# Altium schematic sheet DAC8728_Main_Modified.SchDoc
size A3; Organization: University of Amsterdam; Address1: Technology Centre; DocumentNumber: 1; SheetNumber: 1; SheetTotal: 4
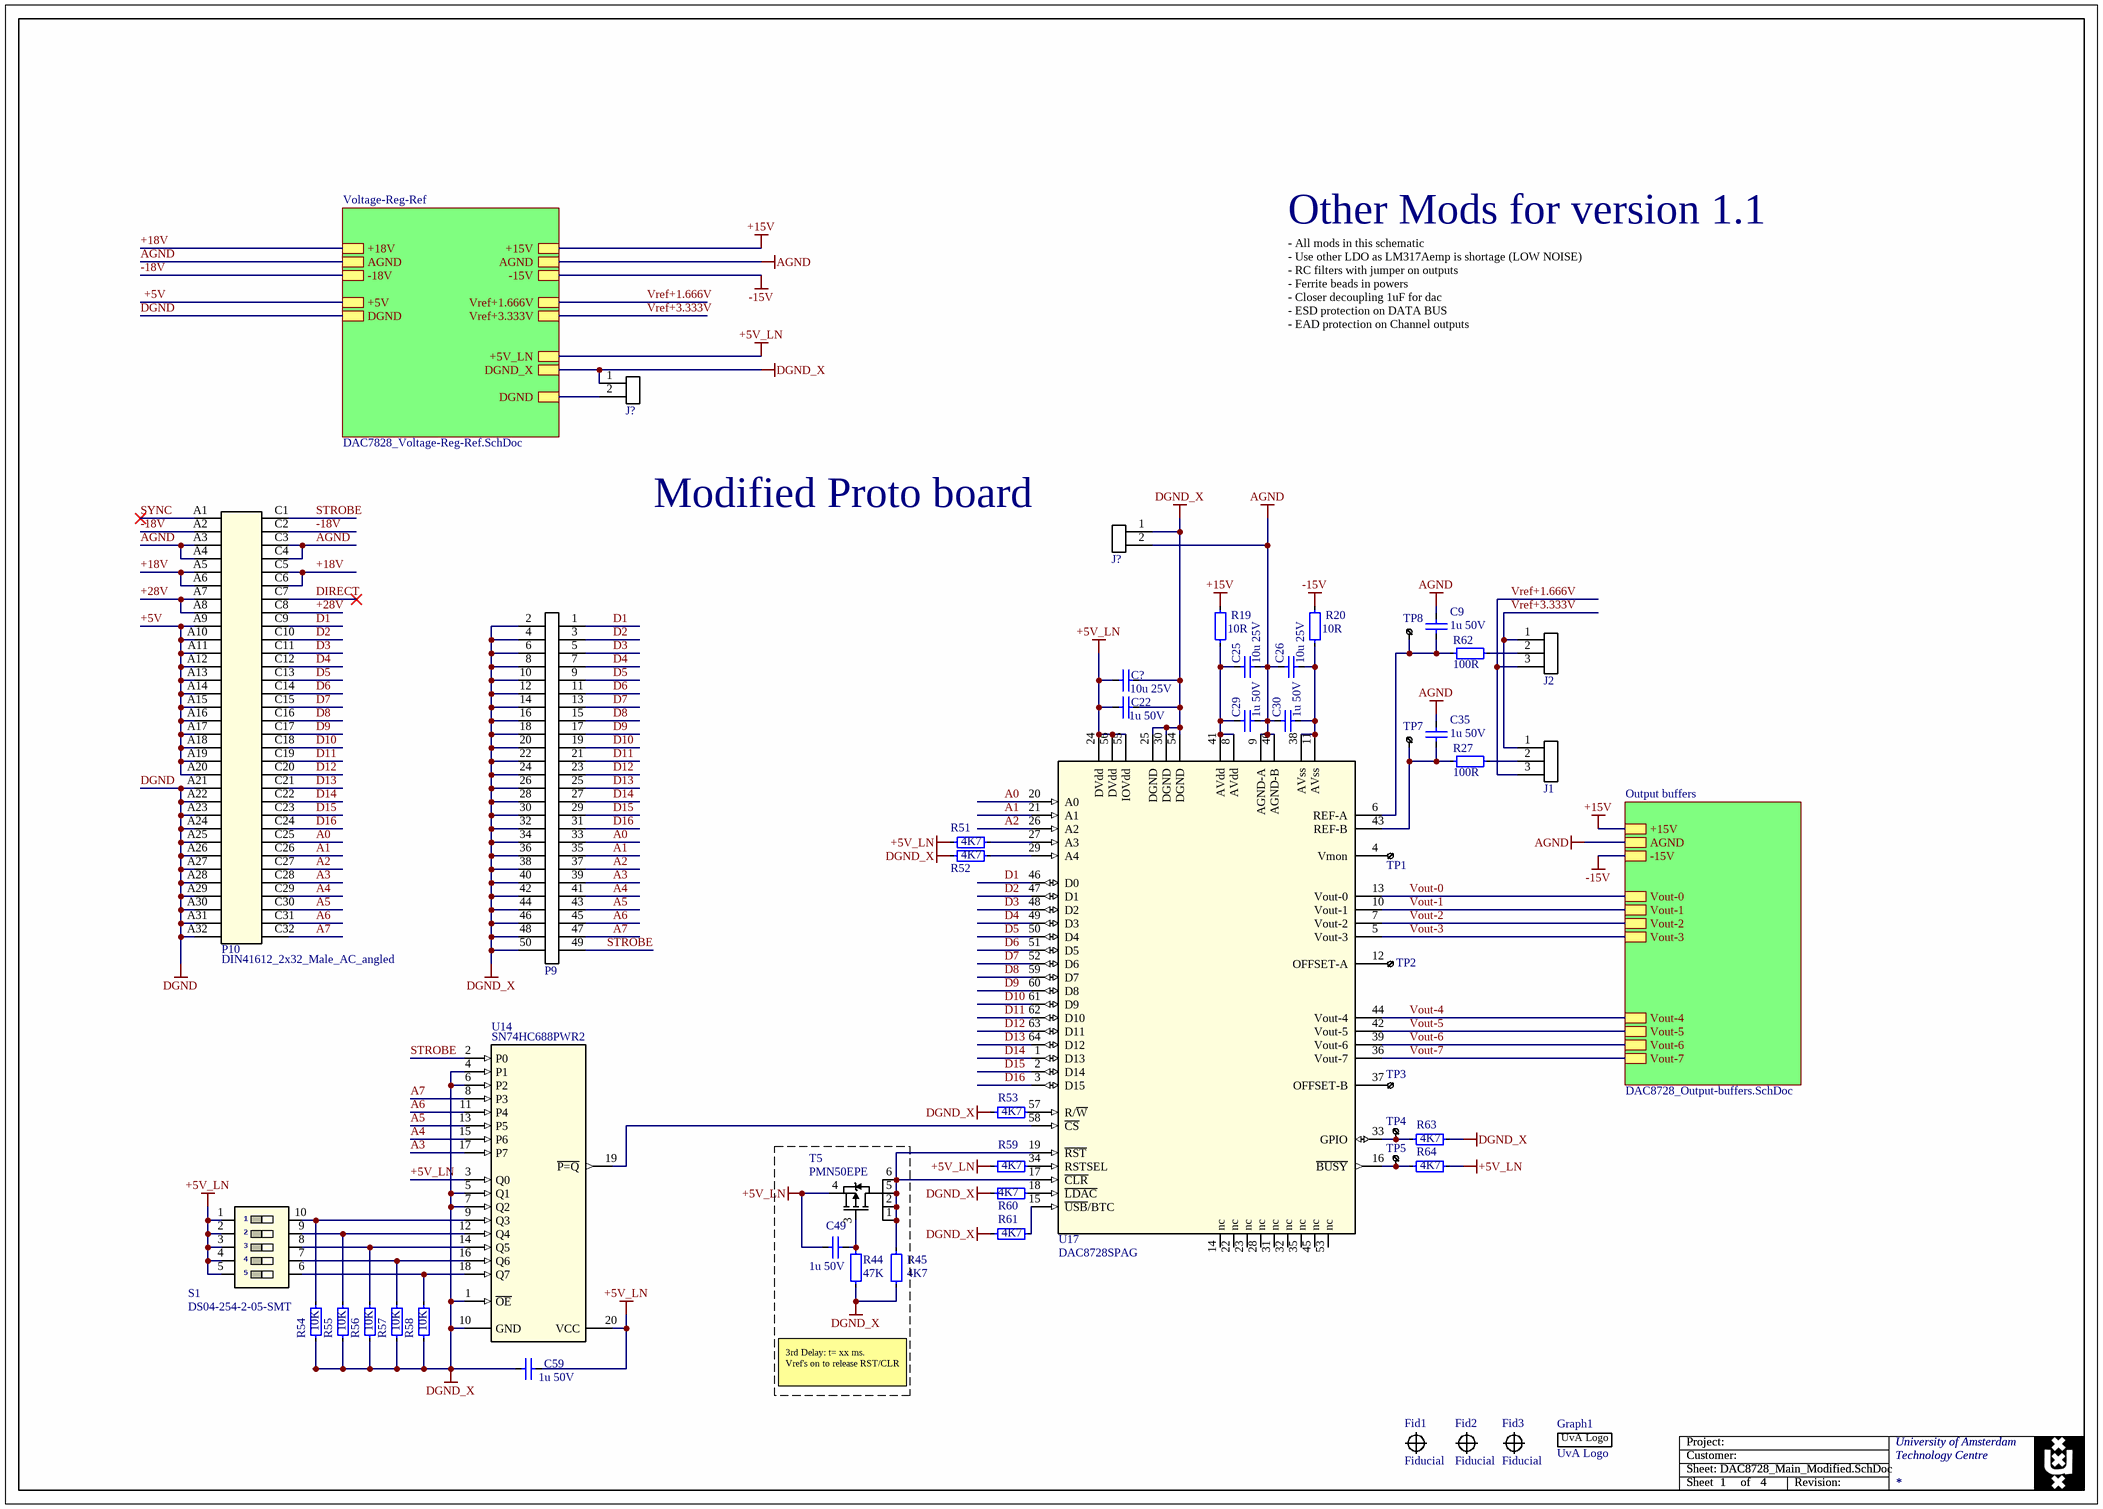
[diagram p0: DAC8728_Main_Modified.SchDoc]

## Parts
(Parts that share a designator on the sheet are numbered #1, #2 ... from top to bottom, then left to right.)
C9  1u 50V  [cap0603MD]
C22  1u 50V  [cap0603MD]
C25  10u 25V  [cap0805MD]
C26  10u 25V  [cap0805MD]
C29  1u 50V  [cap0603MD]
C30  1u 50V  [cap0603MD]
C35  1u 50V  [cap0603MD]
C49  1u 50V  [cap0603MD]
C59  1u 50V  [cap0603MD]
C?  10u 25V  [cap0805MD]
Fid1  Fiducial  [fiducial]
Fid2  Fiducial  [fiducial]
Fid3  Fiducial  [fiducial]
Graph1  UvA Logo  [UvA_Logo]
J1  Header 2.54  [Header254-1x3]  (value not drawn)
J2  Header 2.54  [Header254-1x3]  (value not drawn)
J?#1  Header 2.54  [Header254-1x2]  (value not drawn)
J?#2  Header 2.54  [Header254-1x2]  (value not drawn)
P9  Header 2.54  [Header254-2x25]  (value not drawn)
P10  DIN41612_2x32_Male_AC_angled  [DIN41612_2x32_Male_AC_angled]
R19  10R  [res0603MD]
R20  10R  [res0603MD]
R27  100R  [res0603MD]
R44  47K  [res0603MD]
R45  4K7  [res0603MD]
R51  4K7  [res0603MD]
R52  4K7  [res0603MD]
R53  4K7  [res0603MD]
R54  10K  [res0603HD]
R55  10K  [res0603HD]
R56  10K  [res0603HD]
R57  10K  [res0603HD]
R58  10K  [res0603HD]
R59  4K7  [res0603MD]
R60  4K7  [res0603MD]
R61  4K7  [res0603MD]
R62  100R  [res0603MD]
R63  4K7  [res0603MD]
R64  4K7  [res0603MD]
S1  DS04-254-2-05-SMT  [DS04-254-2-05-SMT]
T5  PMN50EPE  [TSOP95P280X110-6N]
TP1  Testpoint  [Testpoint_1mm]  (value not drawn)  (no BOM)
TP2  Testpoint  [Testpoint_1mm]  (value not drawn)  (no BOM)
TP3  Testpoint  [Testpoint_1mm]  (value not drawn)  (no BOM)
TP4  Testpoint  [Testpoint_1mm]  (value not drawn)  (no BOM)
TP5  Testpoint  [Testpoint_1mm]  (value not drawn)  (no BOM)
TP7  Testpoint  [Testpoint_1mm]  (value not drawn)  (no BOM)
TP8  Testpoint  [Testpoint_1mm]  (value not drawn)  (no BOM)
U14  SN74HC688PWR2  [SOIC127P1030X265-20N]
U17  DAC8728SPAG  [TSQFP50P1200X1200X105-64N]

## Sub-sheets
Output buffers = DAC8728_Output-buffers.SchDoc: +15V, AGND, -15V, Vout-1, Vout-2, Vout-3, Vout-4, Vout-5, Vout-6, Vout-7, Vout-0
Voltage-Reg-Ref = DAC7828_Voltage-Reg-Ref.SchDoc: +18V, AGND, -18V, +5V, DGND, +15V, +5V_LN, AGND, -15V, Vref+1.666V, Vref+3.333V, DGND_X, DGND

## Nets
+5V_LN: C22.1 C49.1 C59.2 C?.1 R51.1 R59.1 R64.2 S1.1(1a) S1.2(2a) S1.3(3a) S1.4(4a) S1.5(5a) T5.4(S) U14.3(Q0) U14.20(VCC) U17.24(DVdd) U17.55(IOVdd) U17.56(DVdd) ; sheet Voltage-Reg-Ref/+5V_LN
+15V: R19.2 ; sheet Voltage-Reg-Ref/+15V, sheet Output buffers/+15V
-15V: R20.2 ; sheet Voltage-Reg-Ref/-15V, sheet Output buffers/-15V
AGND: C9.2 C25.2 C26.1 C29.1 C30.2 C35.2 J?#2.2 P10.A3 P10.A4 P10.C3 P10.C4 U17.9(AGND-A) U17.40(AGND-B) ; sheet Voltage-Reg-Ref/AGND, sheet Voltage-Reg-Ref/AGND, sheet Output buffers/AGND
DGND: P10.A21 P10.A22 P10.A23 P10.A24 P10.A25 P10.A26 P10.A27 P10.A28 P10.A29 P10.A30 P10.A31 P10.A32 ; sheet Voltage-Reg-Ref/DGND
DGND_X: C22.2 C59.1 C?.2 J?#1.1 J?#2.1 P9.2 P9.4 P9.6 P9.8 P9.10 P9.12 P9.14 P9.16 P9.18 P9.20 P9.22 P9.24 P9.26 P9.28 P9.30 P9.32 P9.34 P9.36 P9.38 P9.40 P9.42 P9.44 P9.46 P9.48 P9.50 R44.1 R45.1 R52.1 R53.1 R54.1 R55.1 R56.1 R57.1 R58.1 R60.1 R61.1 R63.2 U14.1(~{OE}) U14.4(P1) U14.5(Q1) U14.6(P2) U14.7(Q2) U14.10(GND) U17.25(DGND) U17.30(DGND) U17.54(DGND) ; sheet Voltage-Reg-Ref/DGND_X
+5V: P10.A9 P10.A10 P10.A11 P10.A12 P10.A13 P10.A14 P10.A15 P10.A16 P10.A17 P10.A18 P10.A19 P10.A20 ; sheet Voltage-Reg-Ref/+5V
+18V: P10.A5 P10.A6 P10.C5 P10.C6 ; sheet Voltage-Reg-Ref/+18V
+28V: P10.A7 P10.A8 P10.C8
-18V: P10.A2 P10.C2 ; sheet Voltage-Reg-Ref/-18V
A0: P9.33 P10.C25 U17.20(A0)
A1: P9.35 P10.C26 U17.21(A1)
A2: P9.37 P10.C27 U17.26(A2)
A3: P9.39 P10.C28 U14.17(P7)
A4: P9.41 P10.C29 U14.15(P6)
A5: P9.43 P10.C30 U14.13(P5)
A6: P9.45 P10.C31 U14.11(P4)
A7: P9.47 P10.C32 U14.8(P3)
D1: P9.1 P10.C9 U17.46(D0)
D2: P9.3 P10.C10 U17.47(D1)
D3: P9.5 P10.C11 U17.48(D2)
D4: P9.7 P10.C12 U17.49(D3)
D5: P9.9 P10.C13 U17.50(D4)
D6: P9.11 P10.C14 U17.51(D5)
D7: P9.13 P10.C15 U17.52(D6)
D8: P9.15 P10.C16 U17.59(D7)
D9: P9.17 P10.C17 U17.60(D8)
D10: P9.19 P10.C18 U17.61(D9)
D11: P9.21 P10.C19 U17.62(D10)
D12: P9.23 P10.C20 U17.63(D11)
D13: P9.25 P10.C21 U17.64(D12)
D14: P9.27 P10.C22 U17.1(D13)
D15: P9.29 P10.C23 U17.2(D14)
D16: P9.31 P10.C24 U17.3(D15)
DIRECT: P10.C7
STROBE: P9.49 P10.C1 U14.2(P0)
SYNC: P10.A1
Vout-0: U17.13(Vout-0) ; sheet Output buffers/Vout-0
Vout-1: U17.10(Vout-1) ; sheet Output buffers/Vout-1
Vout-2: U17.7(Vout-2) ; sheet Output buffers/Vout-2
Vout-3: U17.5(Vout-3) ; sheet Output buffers/Vout-3
Vout-4: U17.44(Vout-4) ; sheet Output buffers/Vout-4
Vout-5: U17.42(Vout-5) ; sheet Output buffers/Vout-5
Vout-6: U17.39(Vout-6) ; sheet Output buffers/Vout-6
Vout-7: U17.36(Vout-7) ; sheet Output buffers/Vout-7
Vref+1.666V: J1.3 J2.3 ; sheet Voltage-Reg-Ref/Vref+1.666V
Vref+3.333V: J1.1 J2.1 ; sheet Voltage-Reg-Ref/Vref+3.333V
NetC9_1: C9.1 R62.1 TP8.1 U17.6(REF-A)
NetC25_1: C25.1 C29.2 R19.1 U17.8(AVdd) U17.41(AVdd)
NetC26_2: C26.2 C30.1 R20.1 U17.11(AVss) U17.38(AVss)
NetC35_1: C35.1 R27.1 TP7.1 U17.43(REF-B)
NetC49_2: C49.2 R44.2 T5.3(G)
NetJ1_2: J1.2 R27.2
NetJ2_2: J2.2 R62.2
NetJ?#1_2: J?#1.2 ; sheet Voltage-Reg-Ref/DGND
NetR45_2: R45.2 T5.1(D) T5.2(D) T5.5(D) T5.6(D) U17.17(~{CLR}) U17.19(~{RST})
NetR51_2: R51.2 U17.27(A3)
NetR52_2: R52.2 U17.29(A4)
NetR53_2: R53.2 U17.57(R/~{W})
NetR54_2: R54.2 S1.10(1b) U14.9(Q3)
NetR55_2: R55.2 S1.9(2b) U14.12(Q4)
NetR56_2: R56.2 S1.8(3b) U14.14(Q5)
NetR57_2: R57.2 S1.7(4b) U14.16(Q6)
NetR58_2: R58.2 S1.6(5b) U14.18(Q7)
NetR59_2: R59.2 U17.34(RSTSEL)
NetR60_2: R60.2 U17.18(~{LDAC})
NetR61_2: R61.2 U17.15(~{USB}/BTC)
NetR63_1: R63.1 TP4.1 U17.33(GPIO)
NetR64_1: R64.1 TP5.1 U17.16(~{BUSY})
NetTP1_1: TP1.1 U17.4(Vmon)
NetTP2_1: TP2.1 U17.12(OFFSET-A)
NetTP3_1: TP3.1 U17.37(OFFSET-B)
NetU14_19: U14.19(~{P=Q}) U17.58(~{CS})

Not connected (* = marked no-connect by the designer): U17 14(nc) 22(nc) 23(nc) 28(nc) 31(nc) 32(nc) 35(nc) 45(nc) 53(nc)

## Notes on the sheet
- Other Mods for version 1.1
- - All mods in this schematic
  - Use other LDO as LM317Aemp is shortage (LOW NOISE)
  - RC filters with jumper on outputs
  - Ferrite beads in powers
  - Closer decoupling 1uF for dac
  - ESD protection on DATA BUS
  - EAD protection on Channel outputs
- (near J?#2) Modified Proto board
- 3rd Delay: t= xx ms.
  Vref's on to release RST/CLR
- Project:
- Customer:
- Sheet
- Sheet:
- of
- Revision:

## Library data of the parts
C9 C22 C29 C30 C35 C49 C59 = Cap0603MD_1u_X5R_50V_10%: id: 123; Precision: 10%; Type: X5R; Author: Twe; Partname: Cap0603MD_1u_X5R_50V_10%; MyComment: 1u 50V; Capacitance: 1u; Supplier 1: Farnell; Supplier Part Number 1: 3013383; CreationDate: 23-Mar-20; Checked by: Unchecked; Voltage: 50V
C25 C26 C? = Cap0805MD_10u_X5R_25V_10%: id: 146; Precision: 10%; Type: 5XR; Author: EB; Partname: Cap0805MD_10u_X5R_25V_10%; MyComment: 10u 25V; Capacitance: 10u; Supplier 1: Farnell; Supplier Part Number 1: 1735530; CreationDate: 31-Mar-16 14:12:18; Checked by: Unchecked; Voltage: 25V
Fid1-Fid3 = Fiducial: id: 1; Author: Twe; Partname: Fiducial; MyComment: Fiducial; Type: Fiducial; Supplier 1: Farnell; CreationDate: 31-Mar-16 09:08:33; Checked by: PCB
Graph1 = UvA_Logo: University of Amsterdam Logo; id: 4; Author: Twe; Partname: UvA_Logo; MyComment: UvA Logo; Type: Logo; Supplier 1: Farnell; CreationDate: 31-Mar-16 13:43:00; Checked by: PCB
J1 J2 = Header254-1x3: Header 2.54p 1x3; id: 33; Author: Twe; Partname: Header254-1x3; MyComment: Header 2.54; Type: Header; Supplier 1: Farnell; Supplier Part Number 1: 1022248; CreationDate: 11-Apr-16 15:00:36; Checked by: PCB
J?#1 J?#2 = Header254-1x2: Header 2.54p 1x2; id: 6; Author: TvR; Partname: Header254-1x2; MyComment: Header 2.54; Type: Header; Supplier 1: Farnell; Supplier Part Number 1: 1022245; CreationDate: 11-Apr-16 15:00:36; Checked by: TvR
P9 = Header254-2x25: Header 2.54p 2x25; Manufacturer: Multicomp; ManufacturerCode: 2213S-50G; id: 146; Author: EB; Partname: Header254-2x25; MyComment: Header 2.54; Type: Header; Supplier 1: Farnell; Supplier Part Number 1: 2847228; CreationDate: 18-Jan-17 13:47:01; Checked by: Unchecked
P10 = DIN41612: Manufacturer: Hartman; id: 144; Author: EB; Partname: DIN41612; MyComment: DIN41612_2x32_Male_AC_angled; Type: Connector; Supplier 1: Farnell; CreationDate: 28-Jun-22 09:22:47; Checked by: Unchecked
R19 R20 = Res0603MD_10R_1%: id: 265; Precision: 1%; Author: Twe; Partname: Res0603MD_10R_1%; MyComment: 10R; Resistance: 10R; Supplier 1: Farnell; Supplier Part Number 1: 2447233; CreationDate: 30-Mar-16 10:33:13; Checked by: Unchecked
R27 R62 = Res0603MD_100R_1%: id: 288; Precision: 1%; Author: TvR; Partname: Res0603MD_100R_1%; MyComment: 100R; Resistance: 100R; Supplier 1: Farnell; Supplier Part Number 1: 1576263; CreationDate: 30-Mar-16 10:33:13; Checked by: Unchecked
R44 = Res0603MD_47K_1%: id: 352; Precision: 1%; Author: Twe; Partname: Res0603MD_47K_1%; MyComment: 47K; Resistance: 47K; Supplier 1: Farnell; Supplier Part Number 1: 2447376; CreationDate: 30-Mar-16 10:33:13; Checked by: Unchecked
R45 R51-R53 R59-R61 R63 R64 = Res0603MD_4K7_1%: id: 328; Precision: 1%; Author: Twe; Partname: Res0603MD_4K7_1%; MyComment: 4K7; Resistance: 4K7; Supplier 1: Farnell; Supplier Part Number 1: 2447385; CreationDate: 30-Mar-16 10:33:13; Checked by: Unchecked
R54-R58 = Res0603HD_10K_1%: id: 534; Precision: 1%; Author: RoKo; Partname: Res0603HD_10K_1%; MyComment: 10K; Resistance: 10K; Supplier 1: Farnell; Supplier Part Number 1: 2446547; CreationDate: 04-Apr-22 10:27:21; Checked by: Unchecked
S1 = DS04-254-2-05-SMT: DIP Switch, 5 SPST, SMD; Manufacturer: CUI Devices; ManufacturerCode: DS04-254-2-05BK-SMT; id: 24; Author: EB; Partname: DS04-254-2-05-SMT; MyComment: DS04-254-2-05-SMT; Type: Switch; Supplier 1: Digi-Key; Supplier Part Number 1: DS04-254-2-05BK-SMT; CreationDate: 05-Jul-22 15:40:19; Checked by: Unchecked
T5 = PMN50EPE: P Channel, MOSFET, -30 V, -6A, 0.045 ohm, SOT457; Manufacturer: NEXPERIA; id: 27; Type: MOSFET P; Author: EB; Partname: PMN50EPE; MyComment: PMN50EPE; ManufacturerCode: PMN50EPE; Supplier 1: Farnell; Supplier Part Number 1: 2900296; CreationDate: 08-Jul-22 12:04:36; Checked by: Unchecked
TP1-TP5 TP7 TP8 = Testpoint_1mm: Testpoint pad 1mm; id: 2; Author: Twe; Partname: Testpoint_1mm; MyComment: Testpoint; Type: Testpoint; Supplier 1: Farnell; CreationDate: 31-Mar-16 13:33:27; Checked by: PCB
U14 = SN74HC688PWR2: 8-Bit Identity Comparators; Manufacturer: Texas Instruments; id: 193; Author: EB; Partname: SN74HC688PWR2; MyComment: SN74HC688PWR2; Type: Logic; ManufacturerCode: SN74HC688PWR2; Supplier 1: Farnell; CreationDate: 12-Jul-22 12:33:51; Checked by: Unchecked
U17 = DAC8728SPAG: Octal, 16-Bit, Low-Power, High-Voltage Output, Parallel Input DAC; Manufacturer: Texas Instruments; id: 185; Author: EB; Partname: DAC8728SPAG; MyComment: DAC8728SPAG; Type: DAC; ManufacturerCode: DAC8728SPAG; Supplier 1: Digi-Key; Supplier Part Number 1: 296-25472-ND; CreationDate: 29-Jun-22 12:22:22; Checked by: Unchecked